# EAGLE design ClockClock_Proto_X40 (EAGLE 9.3.1)
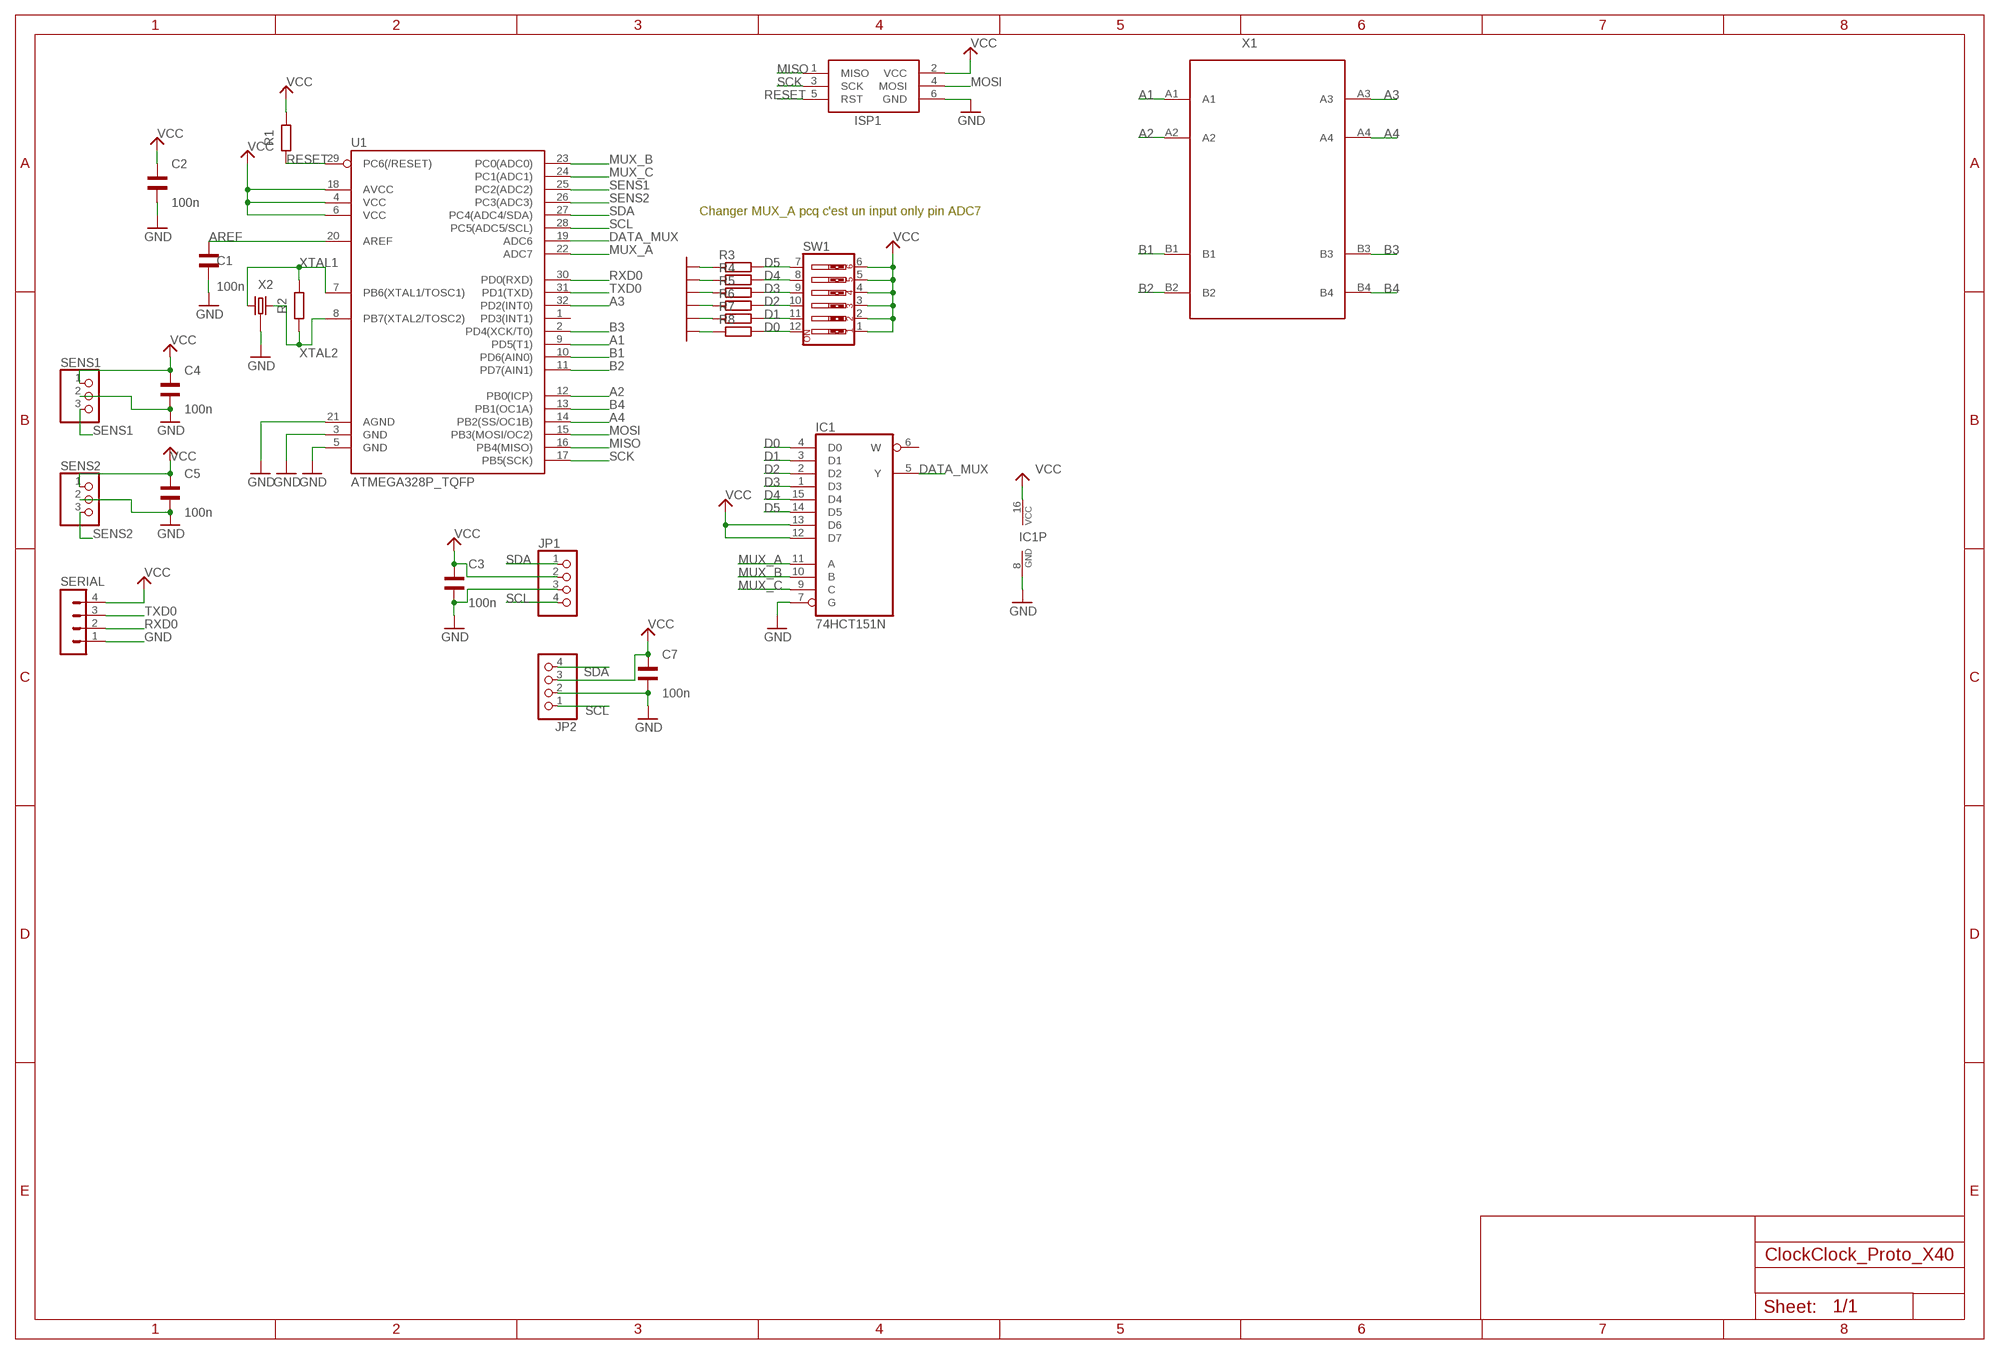
[diagram p0: schematic, sheet 1]

## Parts
C1  100n  WCAP-CSMH_1206_885342208002_WAVE  [WCAP-CSMH_1206_WAVE]
C2  100n  WCAP-CSMH_1206_885342208002_WAVE  [WCAP-CSMH_1206_WAVE]
C3  100n  WCAP-CSMH_1206_885342208002_WAVE  [WCAP-CSMH_1206_WAVE]
C4  100n  WCAP-CSMH_1206_885342208002_WAVE  [WCAP-CSMH_1206_WAVE]
C5  100n  WCAP-CSMH_1206_885342208002_WAVE  [WCAP-CSMH_1206_WAVE]
C7  100n  WCAP-CSMH_1206_885342208002_WAVE  [WCAP-CSMH_1206_WAVE]
IC1  74HCT151N  [DIL16]
ISP1  AVRISP-6  [AVRISP]
JP1  PINHD-1X4/90  [1X04/90]
JP2  PINHD-1X4/90  [1X04/90]
R1  15k  R-EU_R1206  [R1206]
R2  1M  R-EU_R0805  [R0805]
R3  R-EU_R1206  [R1206]
R4  R-EU_R1206  [R1206]
R5  R-EU_R1206  [R1206]
R6  R-EU_R1206  [R1206]
R7  R-EU_R1206  [R1206]
R8  R-EU_R1206  [R1206]
SENS1  PINHD-1X3  [1X03]
SENS2  PINHD-1X3  [1X03]
SERIAL  MA04-1  [MA04-1]
SW1  SWITCH_DIP-6_90  [DIP6_SWITCH_90DEG]
U1  ATMEGA328P_TQFP  [TQFP32-08]
X1  X40_MOTOR  [X40_MOTOR]
X2  AEL_ZTT_RESONATOR_16M  [AEL_ZTT_RESONATOR]

## Nets
A1: U1.9(PD5(T1)) X1.A1
A2: U1.12(PB0(ICP)) X1.A2
A3: U1.32(PD2(INT0)) X1.A3
A4: U1.14(PB2(SS/OC1B)) X1.A4
AREF: C1.2 U1.20(AREF)
B1: U1.10(PD6(AIN0)) X1.B1
B2: U1.11(PD7(AIN1)) X1.B2
B3: U1.2(PD4(XCK/T0)) X1.B3
B4: U1.13(PB1(OC1A)) X1.B4
D0: IC1.4(D0) R8.2 SW1.12
D1: IC1.3(D1) R7.2 SW1.11
D2: IC1.2(D2) R6.2 SW1.10
D3: IC1.1(D3) R5.2 SW1.9
D4: IC1.15(D4) R4.2 SW1.8
D5: IC1.14(D5) R3.2 SW1.7
DATA_MUX: IC1.5(Y) U1.19(ADC6)
GND: C1.1 C2.1 C3.1 C4.1 C5.1 C7.1 IC1.7(G) IC1.8(GND) ISP1.6(GND) JP1.3 JP2.2 R3.1 R4.1 R5.1 R6.1 R7.1 R8.1 SENS1.2 SENS2.2 SERIAL.1 U1.3(GND) U1.5(GND) U1.21(AGND) X2.GND
MISO: ISP1.1(MISO) U1.16(PB4(MISO))
MOSI: ISP1.4(MOSI) U1.15(PB3(MOSI/OC2))
MUX_A: IC1.11(A) U1.22(ADC7)
MUX_B: IC1.10(B) U1.23(PC0(ADC0))
MUX_C: IC1.9(C) U1.24(PC1(ADC1))
RESET: ISP1.5(RST) R1.1 U1.29(PC6(/RESET))
RXD0: SERIAL.2 U1.30(PD0(RXD))
SCK: ISP1.3(SCK) U1.17(PB5(SCK))
SCL: JP1.4 JP2.1 U1.28(PC5(ADC5/SCL))
SDA: JP1.1 JP2.4 U1.27(PC4(ADC4/SDA))
SENS1: SENS1.3 U1.25(PC2(ADC2))
SENS2: SENS2.3 U1.26(PC3(ADC3))
TXD0: SERIAL.3 U1.31(PD1(TXD))
VCC: C2.2 C3.2 C4.2 C5.2 C7.2 IC1.12(D7) IC1.13(D6) IC1.16(VCC) ISP1.2(VCC) JP1.2 JP2.3 R1.2 SENS1.1 SENS2.1 SERIAL.4 SW1.1 SW1.2 SW1.3 SW1.4 SW1.5 SW1.6 U1.4(VCC) U1.6(VCC) U1.18(AVCC) ; supply symbol labelled 5V
XTAL1: R2.2 U1.7(PB6(XTAL1/TOSC1)) X2.P$1
XTAL2: R2.1 U1.8(PB7(XTAL2/TOSC2)) X2.P$3
Unconnected: IC1.6(W) U1.1(PD3(INT1))

## Notes on the sheet
- Changer MUX_A pcq c'est un input only pin ADC7

## Library data of the parts
C1-C5 C7 = Wurth_Elektronik_Passive_Capacitors_rev18b:WCAP-CSMH_1206: WCAP-CSMH Ceramic Capacitors Characteristics MLCC - Multilayer Ceramic Chip Capacitor Recommended soldering: Reflow Wave Soldering only recommended for parts in 0603, 0805, 1206 with a thickness < 1 mm Operating temperature range: –55 °C to +125 °C Available Ceramic Types: Class 1 – NP0 / Class 2 – X7R Applications DC-DC converters Surge and Burst requirements i.e. in I/O applications and ports DC blocking/ High Voltage coupling Snubbers for high frequency converters <http://katalog.we-online.de/media/images/v2/Family_WCAP-CSMH.jpg> Details see: http://katalog.we-online.de/en/pbs/WCAP-CSMH? Created By Yingchun,Shan 2017-07-19 2017 (C) Wurth Elektronik; WE-NUMBER: 885342208002/100nF
IC1 = 74xx-eu:74*151: Data SELECTOR/MULTIPLEXER
ISP1 = adafruit:AVRISP: AVR ISP HEADER Standard 6 pin header for AVR programming
JP1 JP2 = pinhead:PINHD-1X4: PIN HEADER
R1-R8 = resistor:R-EU_: RESISTOR, European symbol
SENS1 SENS2 = adafruit:PINHD-1X3: PIN HEADER
SERIAL = con-lstb:MA04-1: PIN HEADER; OC_FARNELL: unknown; OC_NEWARK: unknown
SW1 = Anthony_Papageorgiou:SWITCH_DIP-6_90: DIP SWITCH
U1 = SparkFun-IC-Microcontroller:ATMEGA328P_TQFP: Popular 328P in QFP Storefront component: ATmega328 - TQFP <https://www.sparkfun.com/products/13448> (COM-13448) Datasheet <http://www.sparkfun.com/datasheets/Components/SMD/ATMega328.pdf> SparkFun Products SparkFun RedBoard - Programmed with Arduino <https://www.sparkfun.com/products/12757> (DEV-12757) Arduino Pro Mini 328 - 5V/16MHz <https://www.sparkfun.com/products/11113> (DEV-11113) Arduino Pro Mini 328 - 3.3V/8MHz <https://www.sparkfun.com/products/11114> (DEV-11114) SparkFun OpenLog <https://www.sparkfun.com/products/13712> (DEV-13712) SparkFun MicroView - OLED Arduino Module <https://www.sparkfun.com/products/12923> (DEV-12923) SparkFun Digital Sandbox <https://www.sparkfun.com/products/12651> (DEV-12651) SparkFun PicoBoard <https://www.sparkfun.com/products/11888> (WIG-11888) Arduino Fio <https://www.sparkfun.com/products/10116> (DEV-10116) LilyPad Arduino 328 Main Board <https://www.sparkfun.com/products/13342> (DEV-13342) SparkFun RedStick <https://www.sparkfun.com/products/13741> (DEV-13741) LilyPad MP3 <https://www.sparkfun.com/products/11013> (DEV-11013) LilyPad Arduino SimpleSnap <https://www.sparkfun.com/products/10941> (DEV-10941) SparkFun Stepoko <https://www.sparkfun.com/products/13899> (ROB-13899) SparkFun Geiger Counter <https://www.sparkfun.com/products/11345> (SEN-11345) SparkFun EL Sequencer <https://www.sparkfun.com/products/12781> (COM-12781) Arduino Pro 328 - 5V/16MHz <https://www.sparkfun.com/products/10915> (DEV-10915) CryptoCape <https://www.sparkfun.com/products/12773> (DEV-12773) SparkFun IR Thermometer Evaluation Board - MLX90614 <https://www.sparkfun.com/products/10740> (SEN-10740) SparkFun RedBot Mainboard <https://www.sparkfun.com/products/12097> (ROB-12097) Arduino Pro 328 - 3.3V/8MHz <https://www.sparkfun.com/products/10914> (DEV-10914) SparkFun Block for Intel® Edison - Arduino <https://www.sparkfun.com/products/13036> (DEV-13036) SparkFun Simon Says - Surface Mount Soldering Kit <https://www.sparkfun.com/products/10935> (KIT-10935) SparkFun 7-Segment Serial Display - Red <https://www.sparkfun.com/products/11441> (COM-11441) SparkFun 7-Segment Serial Display - White <https://www.sparkfun.com/products/11629> (COM-11629) SparkFun 7-Segment Serial Display - Yellow <https://www.sparkfun.com/products/11443> (COM-11443) SparkFun 7-Segment Serial Display - Kelly Green <https://www.sparkfun.com/products/11440> (COM-11440) SparkFun 7-Segment Serial Display - Blue <https://www.sparkfun.com/products/11442> (COM-11442) SparkFun OpenSegment Serial Display - 20mm (Blue) <https://www.sparkfun.com/products/11647> (COM-11647) SparkFun OpenSegment Serial Display - 20mm (Green) <https://www.sparkfun.com/products/11646> (COM-11646) SparkFun OpenSegment Serial Display - 20mm (White) <https://www.sparkfun.com/products/11648> (COM-11648) SparkFun OpenSegment Serial Display - 20mm (Red) <https://www.sparkfun.com/products/11644> (COM-11644) SparkFun OpenSegment Serial Display - 20mm (Yellow) <https://www.sparkfun.com/products/11645> (COM-11645) SparkFun OpenSegment Shield <https://www.sparkfun.com/products/13190> (DEV-13190); PROD_ID: IC-09069
X1 = AAAnthony:X40_MOTOR
X2 = AAAnthony:AEL_ZTT_RESONATOR_16M

## Board
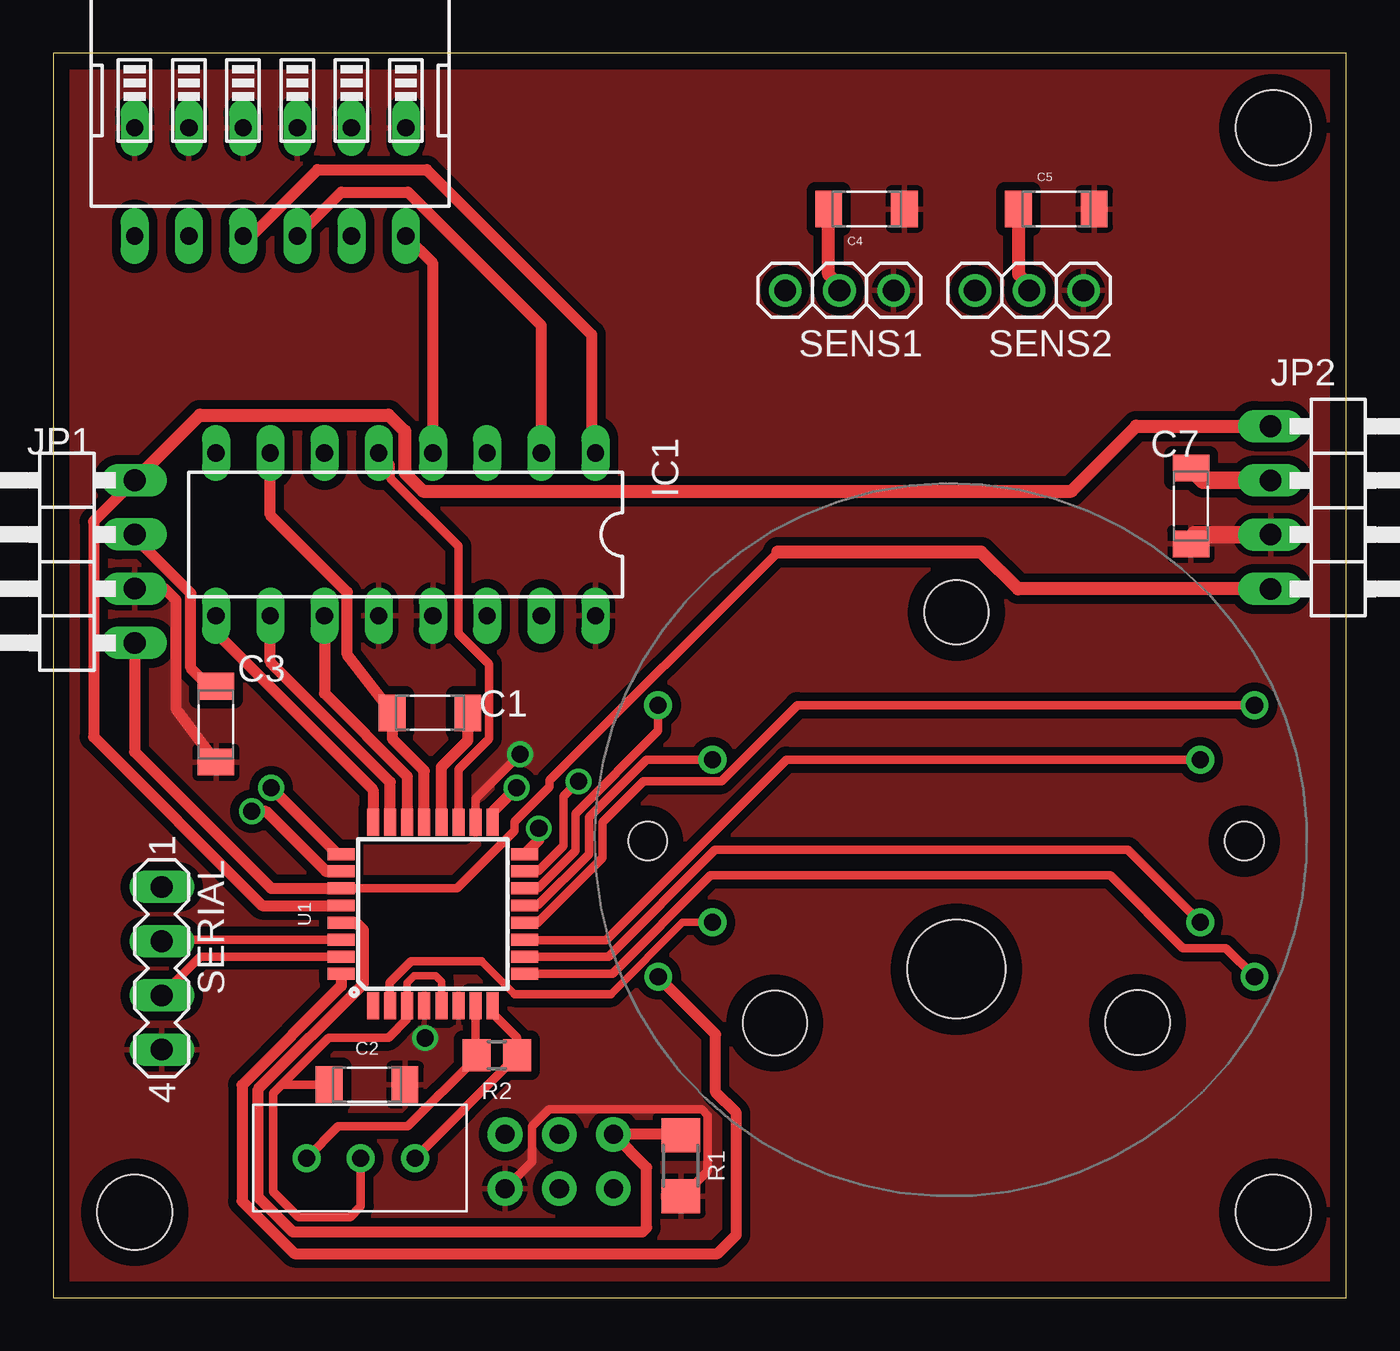
[diagram p1: board, top side]
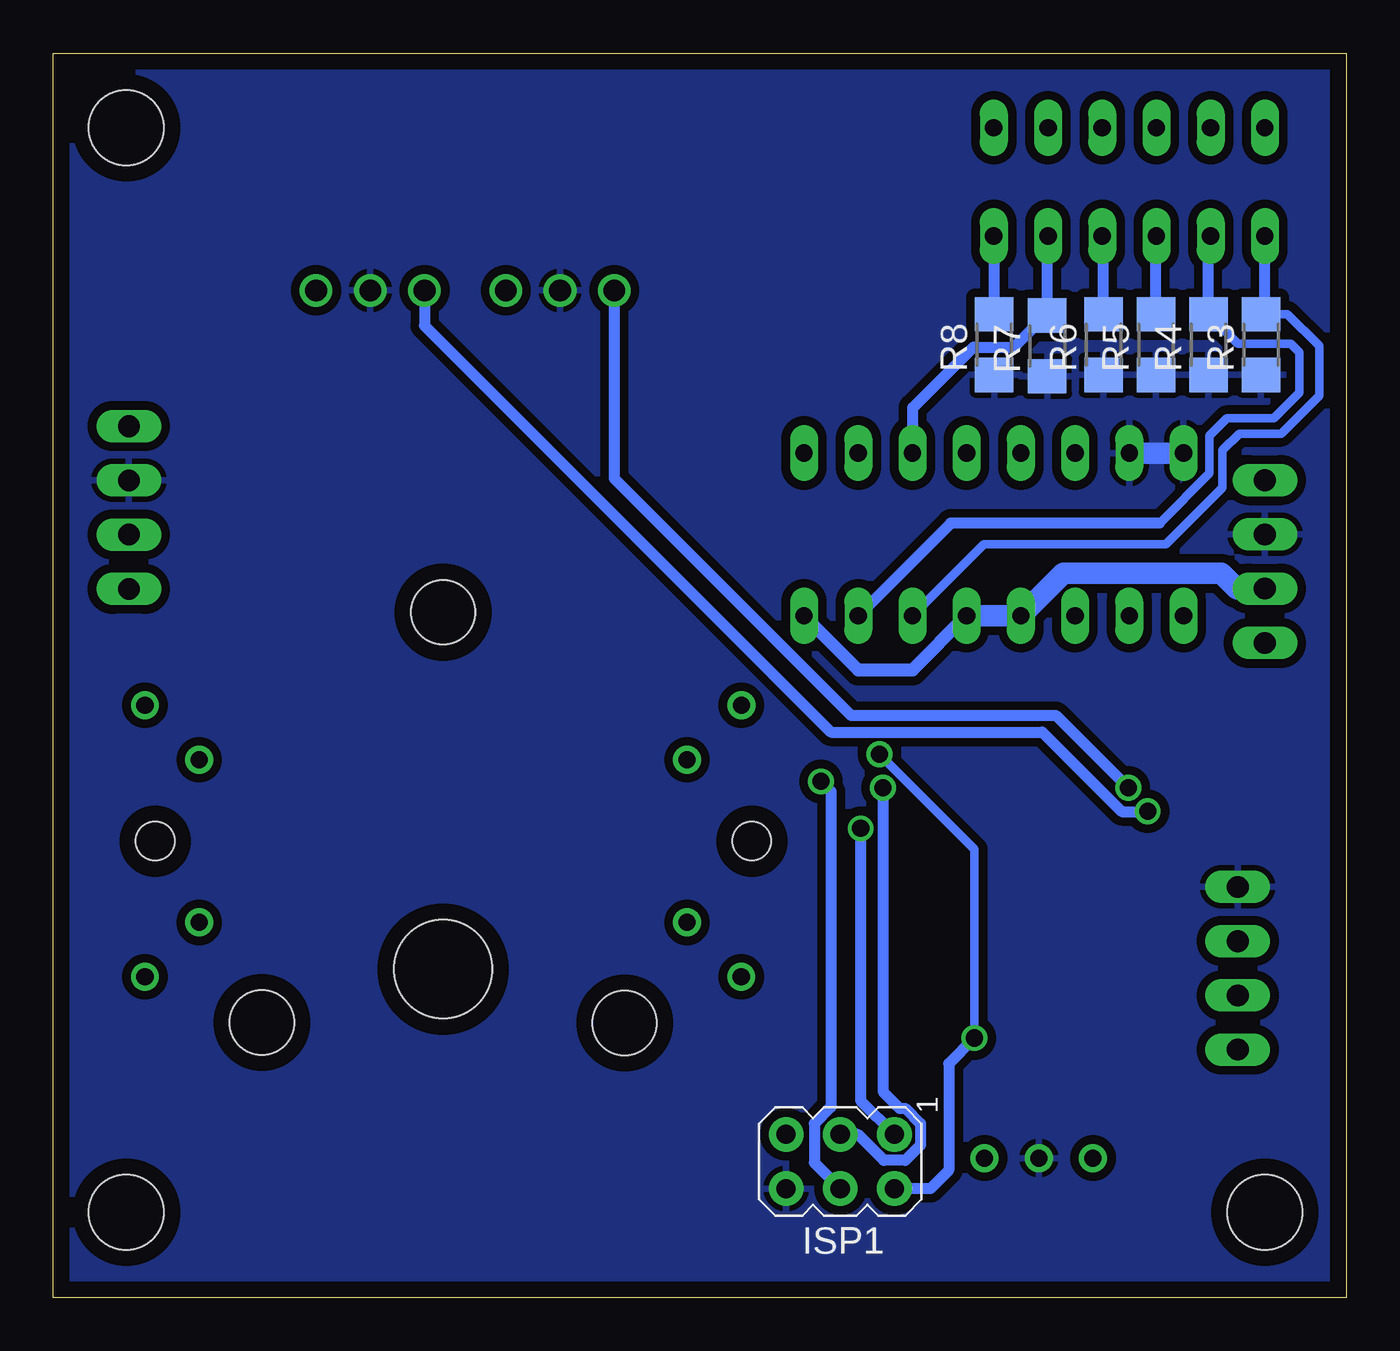
[diagram p2: board, bottom side, seen from below]

Size 60.57 x 58.27 mm. Coordinates in mm from the lower left corner, seen from the top.
Outline: 0,0 60.57,0 60.57,58.27 0,58.27 0,0
Copper layers (1*16): Top 0.035mm / dielectric 1.5mm / Bottom 0.035mm
Design rules "default *": minimum track width 6mil, minimum drill 0.35mm, track to track 6mil, track to pad 6mil, pad to pad 6mil, via to via 6mil, smd to smd 6mil, copper to edge 30mil, drill to drill 6mil, minimum pad ring 10mil, minimum via ring 8mil, stop-mask expansion 4mil, vias tented up to drill 0mil, thermal gap 10mil
Holes 3.5 mm at 57.15,3.99 3.81,3.99 57.15,54.79

### Footprints (pad centres in the part's own frame; a part is rotated, then mirrored left to right if it is on the bottom)
WCAP-CSMH_1206_WAVE = smd 1.25 x 1.7: 1 -1.775,0; 2 1.775,0
DIL16 = drill 0.813 long: 1 -8.89,-3.81; 2 -6.35,-3.81; 3 -3.81,-3.81; 4 -1.27,-3.81; 5 1.27,-3.81; 6 3.81,-3.81; 7 6.35,-3.81; 8 8.89,-3.81; 9 8.89,3.81; 10 6.35,3.81; 11 3.81,3.81; 12 1.27,3.81; 13 -1.27,3.81; 14 -3.81,3.81; 15 -6.35,3.81; 16 -8.89,3.81
AVRISP = drill 0.9 pad 1.626: 1 -1.27,2.54; 2 1.27,2.54; 3 -1.27,0; 4 1.27,0; 5 -1.27,-2.54; 6 1.27,-2.54
1X04/90 = drill 1.016 long: 1 -3.81,-3.81; 2 -1.27,-3.81; 3 1.27,-3.81; 4 3.81,-3.81
R1206 = smd 1.6 x 1.803: 1 -1.422,0; 2 1.422,0
R0805 = smd 1.3 x 1.5: 1 -0.95,0; 2 0.95,0
1X03 = drill 1.016: 1 -2.54,0; 2 0,0; 3 2.54,0
MA04-1 = drill 1.016 long: 1 -3.81,0; 2 -1.27,0; 3 1.27,0; 4 3.81,0
DIP6_SWITCH_90DEG = drill 0.813 long: 1 -6.35,-1.27; 2 -3.81,-1.27; 3 -1.27,-1.27; 4 1.27,-1.27; 5 3.81,-1.27; 6 6.35,-1.27; 7 6.35,3.81; 8 3.81,3.81; 9 1.27,3.81; 10 -1.27,3.81; 11 -3.81,3.81; 12 -6.35,3.81
TQFP32-08 = smd 1.27 x 0.559: 1 -4.293,2.8; 2 -4.293,2; 3 -4.293,1.2; 4 -4.293,0.4; 5 -4.293,-0.4; 6 -4.293,-1.2; 7 -4.293,-2; 8 -4.293,-2.8; 17 4.293,-2.8; 18 4.293,-2; 19 4.293,-1.2; 20 4.293,-0.4; 21 4.293,0.4; 22 4.293,1.2; 23 4.293,2; 24 4.293,2.8 | smd 0.559 x 1.27: 9 -2.8,-4.293; 10 -2,-4.293; 11 -1.2,-4.293; 12 -0.4,-4.293; 13 0.4,-4.293; 14 1.2,-4.293; 15 2,-4.293; 16 2.8,-4.293; 25 2.8,4.293; 26 2,4.293; 27 1.2,4.293; 28 0.4,4.293; 29 -0.4,4.293; 30 -1.2,4.293; 31 -2,4.293; 32 -2.8,4.293
X40_MOTOR = drill 0.8: A1 -5.48,-2.14; A2 -5.48,-14.86; A3 22.46,-2.14; A4 22.464,-14.861; B1 -2.942,-4.69; B2 -2.94,-12.31; B3 19.92,-4.69; B4 19.92,-12.31 | hole 3: 0,0; 8.49,-19.215; 16.997,0.021 | hole 4.6: 8.49,-2.499 | hole 1.8: -5,-8.5; 22.959,-8.5
AEL_ZTT_RESONATOR = drill 0.8: GND 3.94,-1.3; P$1 1.4,-1.3; P$3 6.48,-1.3

### Placement (x,y rotation side)
C1  17.65,27.38 0 top
C2  14.7,9.97 0 top
C3  7.62,26.85 270 top
C4  38.1,50.98 0 top
C5  46.99,50.98 0 top
C7  53.3,37.07 270 top
IC1  16.51,35.74 180 top
ISP1  23.7,6.37 270 bottom
JP1  0,34.47 90 top
JP2  60.84,37 270 top
R1  29.4,6.17 270 top
R2  20.78,11.34 180 top
R3  3.99,44.63 90 bottom
R4  6.45,44.63 90 bottom
R5  8.91,44.63 90 bottom
R6  11.37,44.63 90 bottom
R7  14,44.57 90 bottom
R8  16.49,44.63 90 bottom
SENS1  36.83,47.17 180 top
SENS2  45.72,47.17 180 top
SERIAL  5.08,15.42 270 top
SW1  10.16,53.52 180 top
U1  17.78,17.96 90 top
X1  50.8,12.88 180 top
X2  10.46,7.83 0 top

### Tracks (layer width: path | path; a pad name or v marks a point on that pad's centre or on a via)
A1
  Top 0.406: U1.9 26.19,15.16 30.8,19.77 49.51,19.77 52.92,16.36 54.94,16.36 X1.A1
A2
  Top 0.406: U1.12 22.11,17.52 22.65,17.52 25.72,20.59 25.72,22.26 27.64,24.18 31.3,24.18 34.86,27.74 X1.A2
A3
  Top 0.508: U1.32 13.49,14.6 8.84,9.95 8.84,4.52 11.3,2.05 31.12,2.05 32,2.93 32,8.64 31.03,9.61 31.03,12.33 X1.A3
A4
  Top 0.406: X1.A4 28.34,26.54 24.46,22.67 24.46,20.93 22.7,19.18 22.09,19.18 U1.14
AREF
  Top 0.508: U1.20 18.18,24.85 19.42,26.09 C1.2
B1
  Top 0.406: U1.10 22.08,15.97 26.02,15.97 31.01,20.96 50.35,20.96 X1.B1
B2
  Top 0.406: U1.11 22.11,16.72 25.88,16.72 34.35,25.19 X1.B2
B3
  Top 0.35: 26.12,14.21 29.48,17.57 X1.B3 | 20.06,15.76 21.6,14.21
  Top 0.406: U1.2 15.74,13.7 15.74,14.75 16.75,15.76 20.06,15.76 | 21.6,14.21 26.12,14.21
B4
  Top 0.406: U1.13 22.7,18.36 25.1,20.77 25.1,22.49 27.8,25.19 X1.B4
D0
  Top 0.508: SW1.12 17.78,48.44 IC1.4
  Bottom 0.508: R8.2 16.49,49.69 SW1.12
D1
  Bottom 0.508: SW1.11 14,49.68 R7.2 14.1,45.99 15.58,44.51 17.46,44.51 20.3,41.68 20.3,39.57 IC1.3
D2
  Top 0.508: SW1.10 13.49,51.77 16.62,51.77 22.86,45.53 IC1.2
  Bottom 0.508: R6.2 11.37,49.65 SW1.10
D3
  Top 0.508: IC1.1 25.22,39.73 25.22,45.1 17.49,52.83 12.38,52.83 9.26,49.71 SW1.9
  Bottom 0.508: R5.2 8.91,49.69 SW1.9
D4
  Bottom 0.406: R4.2 5.07,44.67 2.6,44.67 2.2,44.27 2.2,42.37 3.4,41.17 5.6,41.17 6.4,40.37 6.4,38.6 8.73,36.27
  Bottom 0.508: R4.2 6.45,49.61 SW1.8 | 8.73,36.27 18.52,36.27 IC1.15
D5
  Bottom 0.406: IC1.14 16.98,35.27 8.44,35.27 5.79,37.92 5.79,39.68 5.01,40.46 3.05,40.46 1.27,42.24 1.27,44.57 2.75,46.05 R3.2
  Bottom 0.508: R3.2 3.81,46.23 SW1.7
DATA_MUX
  Top 0.406: IC1.5 15.8,38.99 15.8,38.36 18.98,35.17 18.98,31.1 20.41,29.67 20.41,26.18 18.98,24.75 U1.19
GND
  Top 0.35: U1.5 18.18,14.79 17.9,15.07 16.9,15.07 16.58,14.75 U1.3
  Top 0.406: U1.3 16.58,13.05 15.7,12.17 12.9,12.17 10.7,9.97 | X2.GND 14.4,4.27 13.9,3.77 11.48,3.77 10.3,4.95 10.3,9.57 10.7,9.97 | C2.1 10.7,9.97
  Top 0.508: U1.21 17.38,24.67 15.88,26.17 C1.1 13.77,30.11 13.77,33.03 10.16,36.64 IC1.7 | 36.95,47.29 SENS1.2 | 45.84,47.29 SENS2.2 | C3.1 7.43,28.49 6.44,29.48 6.44,32.98 3.81,35.61 JP1.3
  Top 0.61: 36.95,47.29 36.32,47.91 C4.1 | C5.1 45.21,47.91 45.84,47.29
  Top 0.813: C7.1 53.88,38.27 JP2.2
  Bottom 1.016: IC1.8 IC1.7
  pour Bottom (isolate 0.406): 0,58.27 60.57,58.27 60.57,0 0,0
MISO  (via drill 0.8)
  Top 0.508: v22.75,21.97 22.75,21.43 U1.16
  Bottom 0.508: v22.75,21.97 22.75,9.23 ISP1.1
MOSI  (via drill 0.8)
  Top 0.406: v24.6,24.17 23.9,23.47 23.9,21.16 22.7,19.96 U1.15
  Bottom 0.508: v24.6,24.17 24.13,23.7 24.13,8.93 24.92,8.14 24.92,6.32 ISP1.4
MUX_A
  Top 0.508: IC1.11 12.7,28.29 16.58,24.41 U1.22
MUX_B
  Top 0.508: IC1.10 10.16,29.76 15.78,24.14 U1.23
MUX_C
  Top 0.508: IC1.9 7.62,31.13 14.98,23.77 U1.24
RESET
  Top 0.508: U1.29 14.18,17.56 14.53,17.21 14.53,14.7 9.6,9.78 9.6,4.69 11.22,3.07 27.6,3.07 27.8,3.27 27.8,6.08 ISP1.5 29.35,7.64 R1.1
RXD0
  Top 0.406: U1.30 5.15,16.76 SERIAL.2
SCK  (via drill 0.8)
  Top 0.508: v21.7,23.87 20.58,22.75 U1.17
  Bottom 0.508: v21.7,23.87 21.7,9.64 20.92,8.86 20.65,8.86 19.94,8.14 19.94,7.13 20.65,6.42 21.66,6.42 22.88,7.64 ISP1.3
SCL
  Top 0.508: JP1.4 1.88,36.35 1.88,26.26 9.78,18.36 U1.28
  Top 0.61: JP1.4 6.86,41.33 15.7,41.33 16.46,40.57 16.46,38.63 17.32,37.77 47.7,37.77 50.74,40.81 JP2.1
SDA
  Top 0.406: U1.27 18.9,19.16 21.61,21.87 21.61,22.29 23.25,23.92 23.25,24.22 33.95,34.92
  Top 0.508: JP1.1 3.81,25.56 10.21,19.16 U1.27
  Top 0.61: JP2.4 45.2,33.19 43.48,34.92 33.95,34.92
SENS1  (via drill 0.8)
  Top 0.508: v10.2,23.87 13.31,20.76 U1.25
  Bottom 0.508: v10.2,23.87 13.6,27.27 23.2,27.27 34.29,38.36 SENS1.3
SENS2  (via drill 0.8)
  Top 0.508: v9.3,22.77 9.97,22.77 12.78,19.96 U1.26
  Bottom 0.508: v9.3,22.77 v9.31,22.76 10.52,22.76 14.24,26.48 24.14,26.48 43.18,45.52 SENS2.3
TXD0
  Top 0.406: U1.31 6.89,15.96 SERIAL.3
VCC  (via drill 0.8)
  Top 0.406: U1.18 19.78,23.36 v21.87,25.44 | R1.2 29.5,4.75 30.66,5.9 30.66,8.54 30.39,8.81 23.22,8.81 22.43,8.02 22.43,6.37 ISP1.2
  Top 0.508: JP1.2 5.21,33.2 5.74,32.67 5.74,27.58 C3.2
  Top 0.813: C7.2 53.49,35.73 JP2.3
  Bottom 0.406: v21.87,25.44 17.41,20.99 v17.41,12.16
  Bottom 0.508: v17.41,12.16 18.61,10.96 18.61,5.96 19.47,5.1 ISP1.2
  Bottom 0.61: IC1.13 20.32,29.39 22.86,29.39 IC1.16
  Bottom 1.016: IC1.13 IC1.12 13.26,33.91 5.84,33.91 5.13,33.2 JP1.2
  pour Top (isolate 0.406): 0,58.27 60.6,58.27 60.6,0.07 0,0.07
XTAL1
  Top 0.406: X2.P$1 13.35,8.02 16.61,8.02 19.83,11.24 R2.2 19.78,11.39 U1.7
XTAL2
  Top 0.406: U1.8 20.58,13.31 21.73,12.16 R2.1 21.73,11.32 X2.P$3